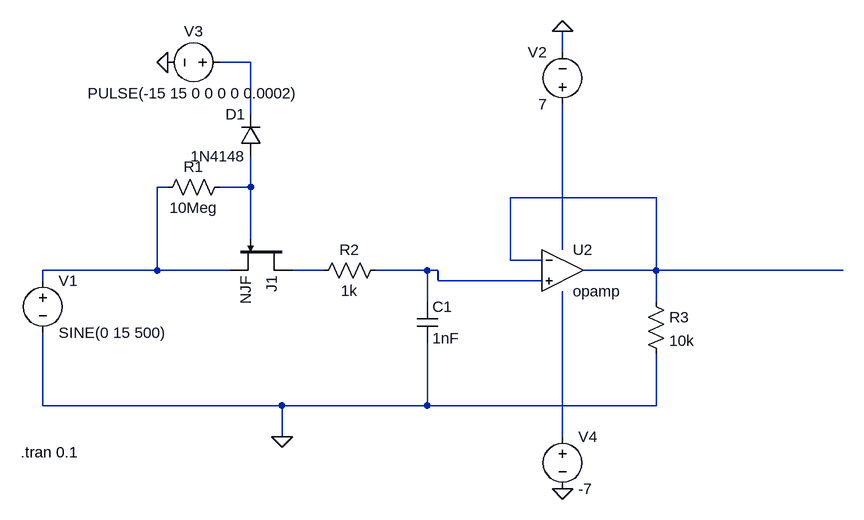
[diagram p0: schematic S&H.asc]
S&H.asc, the LTspice schematic file:
Version 4
SHEET 1 968 680
WIRE 464 -224 464 -256
WIRE -16 -208 -64 -208
WIRE -16 -128 -16 -208
WIRE -144 -16 -160 -16
WIRE -16 -16 -16 -64
WIRE -16 -16 -64 -16
WIRE 608 0 384 0
WIRE -16 64 -16 -16
WIRE 464 80 464 -144
WIRE 384 96 384 0
WIRE 432 96 384 96
WIRE -160 112 -160 -16
WIRE -160 112 -336 112
WIRE -48 112 -160 112
WIRE 96 112 48 112
WIRE 256 112 176 112
WIRE 272 112 256 112
WIRE 608 112 608 0
WIRE 608 112 496 112
WIRE 896 112 608 112
WIRE -336 128 -336 112
WIRE 272 128 272 112
WIRE 432 128 272 128
WIRE 256 160 256 112
WIRE 608 160 608 112
WIRE -336 320 -336 208
WIRE 32 320 -336 320
WIRE 256 320 256 224
WIRE 256 320 32 320
WIRE 608 320 608 240
WIRE 608 320 256 320
WIRE 32 368 32 320
WIRE 464 368 464 144
FLAG 32 368 0
FLAG 464 -256 0
FLAG -144 -208 0
FLAG 464 448 0
SYMBOL res -48 -32 R90
WINDOW 0 0 56 VBottom 2
WINDOW 3 32 56 VTop 2
SYMATTR InstName R1
SYMATTR Value 10Meg
SYMATTR SpiceLine tol=1 pwr=0.1
SYMBOL diode 0 -64 R180
WINDOW 0 24 64 Left 2
WINDOW 3 24 0 Left 2
SYMATTR InstName D1
SYMATTR Value 1N4148
SYMBOL njf 48 64 R90
SYMATTR InstName J1
SYMBOL res 192 96 R90
WINDOW 0 0 56 VBottom 2
WINDOW 3 32 56 VTop 2
SYMATTR InstName R2
SYMATTR Value 1k
SYMBOL cap 240 160 R0
SYMATTR InstName C1
SYMATTR Value 1nF
SYMBOL voltage -336 112 R0
WINDOW 123 0 0 Left 0
WINDOW 39 0 0 Left 0
SYMATTR InstName V1
SYMATTR Value SINE(0 15 500)
SYMBOL res 592 144 R0
SYMATTR InstName R3
SYMATTR Value 10k
SYMBOL voltage 464 -128 R180
WINDOW 0 24 96 Left 2
WINDOW 3 24 16 Left 2
WINDOW 123 0 0 Left 0
WINDOW 39 0 0 Left 0
SYMATTR InstName V2
SYMATTR Value 7
SYMBOL voltage -48 -208 R90
WINDOW 0 -32 56 VBottom 2
WINDOW 3 32 56 VTop 2
WINDOW 123 0 0 Left 0
WINDOW 39 0 0 Left 0
SYMATTR InstName V3
SYMATTR Value PULSE(-15 15 0 0 0 0 0.0002)
SYMBOL voltage 464 352 R0
WINDOW 123 0 0 Left 0
WINDOW 39 0 0 Left 0
SYMATTR InstName V4
SYMATTR Value -7
SYMBOL Opamps\\opamp 464 48 R0
SYMATTR InstName U2
TEXT -370 392 Left 2 !.tran 0.1

The netlist it stands for:
* S&H.asc
R1 N003 N002 10Meg tol=1 pwr=0.1
D1 N003 N001 1N4148
J1 N006 N003 N002 NJF
R2 N007 N006 1k
C1 N007 0 1nF
V1 N002 0 SINE(0 15 500)
R3 N004 0 10k
V2 N005 0 7
V3 N001 0 PULSE(-15 15 0 0 0 0 0.0002)
V4 N008 0 -7
XU2 N004 N007 N004 opamp Aol=100K GBW=10Meg  ; pins invin noninvin out
.model D D
.lib standard.dio
.model NJF NJF
.model PJF PJF
.lib standard.jft
.tran 0.1
.backanno
.end